# Altium project SnekHeaderBoard.PrjPCB
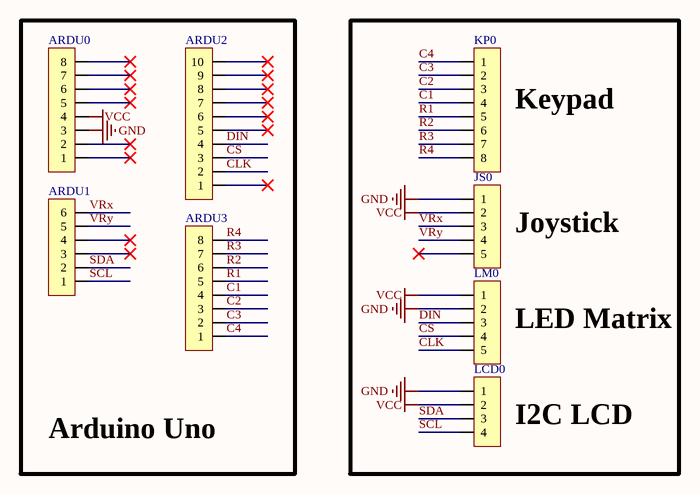
[diagram p0: SnekHeaderBoard.SchDoc]
1 sheet, 8 parts. Net scope: global (net labels, ports and power ports of the same name join across sheets).
Board file: SnekHeaderBoard.PcbDoc

## Sheet SnekHeaderBoard.SchDoc
size A4

### Parts
ARDU0  Header 8  [Header 8]  (value not drawn)
ARDU1  Header 6  [Header 6]  (value not drawn)
ARDU2  Header 10  [Header 10]  (value not drawn)
ARDU3  Header 8  [Header 8]  (value not drawn)
JS0  Header 5  [Header 5]  (value not drawn)
KP0  Header 8  [Header 8]  (value not drawn)
LCD0  Header 4  [Header 4]  (value not drawn)
LM0  Header 5  [Header 5]  (value not drawn)

### Blocks framed on the sheet
Arduino Uno: ARDU0-ARDU3

### Nets
GND: ARDU0.3 JS0.1 LCD0.1 LM0.2
VCC: ARDU0.4 JS0.2 LCD0.2 LM0.1
C1: ARDU3.4 KP0.4
C2: ARDU3.3 KP0.3
C3: ARDU3.2 KP0.2
C4: ARDU3.1 KP0.1
CLK: ARDU2.2 LM0.5
CS: ARDU2.3 LM0.4
DIN: ARDU2.4 LM0.3
R1: ARDU3.5 KP0.5
R2: ARDU3.6 KP0.6
R3: ARDU3.7 KP0.7
R4: ARDU3.8 KP0.8
SCL: ARDU1.1 LCD0.4
SDA: ARDU1.2 LCD0.3
VRx: ARDU1.6 JS0.3
VRy: ARDU1.5 JS0.4

Not connected (* = marked no-connect by the designer): ARDU0 1* 2* 5* 6* 7* 8*; ARDU1 3* 4*; ARDU2 1* 5* 6* 7* 8* 9* 10*; JS0 5*

### Notes on the sheet
- (near KP0) Keypad
- Joystick
- LED Matrix
- I2C LCD

### Library data of the parts
ARDU0 ARDU3 KP0 = Header 8: Header, 8-Pin; LatestRevisionDate: 17-Jul-2002; LatestRevisionNote: Re-released for DXP Platform.; Publisher: Altium Limited
ARDU1 = Header 6: Header, 6-Pin
ARDU2 = Header 10: Header, 10-Pin
JS0 LM0 = Header 5: Header, 5-Pin; LatestRevisionDate: 17-Jul-2002; LatestRevisionNote: Re-released for DXP Platform.; Publisher: Altium Limited
LCD0 = Header 4: Header, 4-Pin